# Altium schematic sheet SerialKM.SchDoc
size A4; ENG_APP_DATE: --/--/--; DSN_APP_DATE: --/--/--; CHK_APP_DATE: --/--/--; SheetNumber: 1; SheetTotal: 1
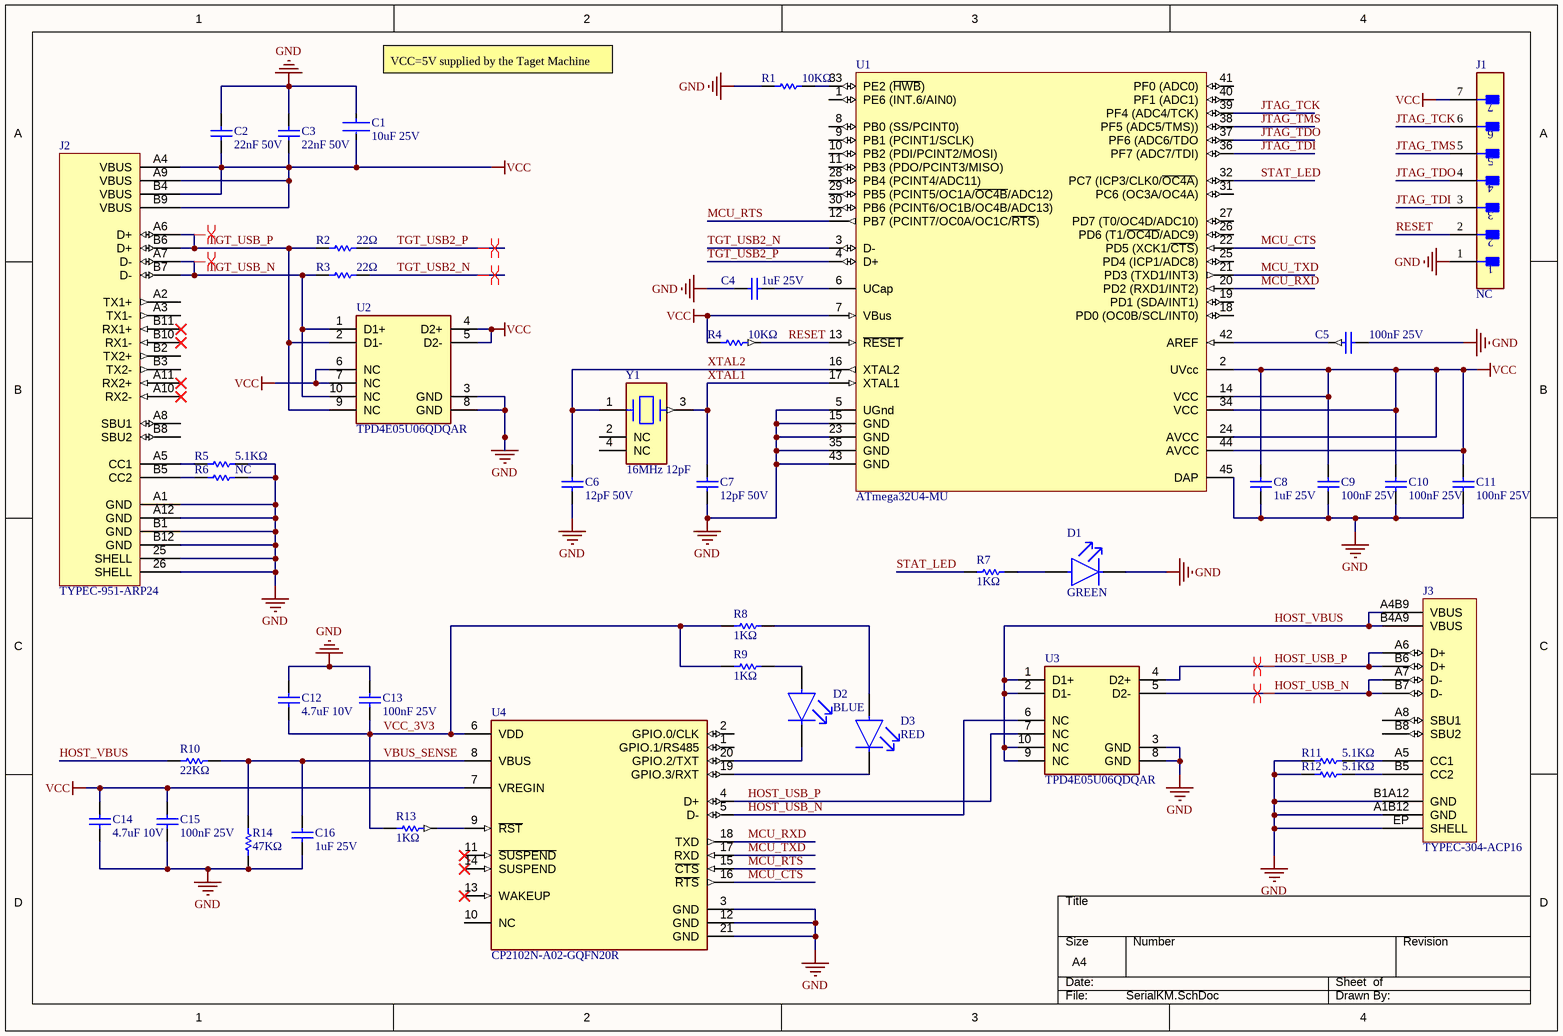
[diagram p0: SerialKM.SchDoc]

## Parts
C1  10uF 25V  [FP-C1608-080-MFG]
C2  22nF 50V  [CAPC1005X56X25LL10T15]
C3  22nF 50V  [CAPC1005X56X25LL10T15]
C4  1uF 25V  [CAPC1005X55X10LL05]
C5  100nF 25V  [CAPC1005X55X30LL05T10]
C6  12pF 50V  [CAPC1005X61X26LL10T16]
C7  12pF 50V  [CAPC1005X61X26LL10T16]
C8  1uF 25V  [CAPC1005X55X10LL05]
C9  100nF 25V  [CAPC1005X55X30LL05T10]
C10  100nF 25V  [CAPC1005X55X30LL05T10]
C11  100nF 25V  [CAPC1005X55X30LL05T10]
C12  4.7uF 10V  [CAPC1005X70X10LL20T00]
C13  100nF 25V  [CAPC1005X55X30LL05T10]
C14  4.7uF 10V  [CAPC1005X70X10LL20T00]
C15  100nF 25V  [CAPC1005X55X30LL05T10]
C16  1uF 25V  [CAPC1005X55X10LL05]
D1  GREEN  [FP-APHHS1005CGCK-MFG]
D2  BLUE  [FP-APHHS1005CGCK-MFG]
D3  RED  [FP-APHHS1005CGCK-MFG]
J1  NC  [FP-GRPB071VWVN-RC-MFG]  (no BOM)
J2  TYPEC-951-ARP24  [TYPEC-951-ARP24]
J3  TYPEC-304-ACP16  [TYPEC-304-ACP16]
R1  10KΩ  [RESC1005X40X25LL05T10]
R2  22Ω  [RESC1005X40X25LL05T05]
R3  22Ω  [RESC1005X40X25LL05T05]
R4  10KΩ  [RESC1005X40X25LL05T10]
R5  5.1KΩ  [RESC1005X40X25LL05T10]
R6  NC  [RESC1005X40X25LL05T10]
R7  1KΩ  [RESC1005X40X25LL05T10]
R8  1KΩ  [RESC1005X40X25LL05T10]
R9  1KΩ  [RESC1005X40X25LL05T10]
R10  22KΩ  [RESC1005X40X25LL05T10]
R11  5.1KΩ  [RESC1005X40X25LL05T10]
R12  5.1KΩ  [RESC1005X40X25LL05T10]
R13  1KΩ  [RESC1005X40X25LL05T10]
R14  47KΩ  [RESC1005X40X25LL05T10]
U1  ATmega32U4-MU  [44PW_L]
U2  TPD4E05U06QDQAR  [FP-DQA0010A-MFG]
U3  TPD4E05U06QDQAR  [FP-DQA0010A-MFG]
U4  CP2102N-A02-GQFN20R  [FP-CP2102N-A02-GQFN20R-MFG]
Y1  16MHz 12pF  [FP-XRCGB-MFG]

## Nets
GND: C1.1 C2.2 C3.2 C4.1 C5.1 C6.1 C7.1 C8.2 C9.1 C10.1 C11.1 C12.2 C13.2 C14.1 C15.1 C16.1 D1.1(C) J1.1 J2.25(SHELL) J2.26(SHELL) J2.A1(GND) J2.A12(GND) J2.B1(GND) J2.B12(GND) J3.A1B12(GND) J3.B1A12(GND) J3.EP(SHELL) R1.2 R5.2 R6.2 R11.1 R12.1 R14.1 U1.5(UGnd) U1.15(GND) U1.23(GND) U1.35(GND) U1.43(GND) U1.45(DAP) U2.3(GND) U2.8(GND) U3.3(GND) U3.8(GND) U4.3(GND) U4.12(GND) U4.21(GND)
VCC: C1.2 C2.1 C3.1 C8.1 C9.2 C10.2 C11.2 C14.2 C15.2 J1.7 J2.A4(VBUS) J2.A9(VBUS) J2.B4(VBUS) J2.B9(VBUS) R4.2 U1.2(UVcc) U1.7(VBus) U1.14(VCC) U1.24(AVCC) U1.34(VCC) U1.44(AVCC) U2.4(D2+) U2.5(D2-) U2.6(NC) U2.7(NC) U4.7(VREGIN)
HOST_USB_N: J3.A7(D-) J3.B7(D-) U3.5(D2-) U3.6(NC) U4.5(D-)
HOST_USB_P: J3.A6(D+) J3.B6(D+) U3.4(D2+) U3.7(NC) U4.4(D+)
HOST_VBUS: J3.A4B9(VBUS) J3.B4A9(VBUS) R10.1 U3.1(D1+) U3.2(D1-) U3.9(NC) U3.10(NC)
JTAG_TCK: J1.6 U1.39(PF4_(ADC4/TCK))
JTAG_TDI: J1.3 U1.36(PF7_(ADC7/TDI))
JTAG_TDO: J1.4 U1.37(PF6_(ADC6/TDO)
JTAG_TMS: J1.5 U1.38(PF5_(ADC5/TMS)))
MCU_CTS: U1.22(PD5_(XCK1/~{CTS})) U4.16(~{RTS})
MCU_RTS: U1.12(PB7_(PCINT7/OC0A/OC1C/~{RTS})) U4.15(~{CTS})
MCU_RXD: U1.20(PD2_(RXD1/INT2)) U4.18(TXD)
MCU_TXD: U1.21(PD3_(TXD1/INT3)) U4.17(RXD)
RESET: J1.2 R4.1 U1.13(~{RESET})
STAT_LED: R7.1 U1.32(PC7_(ICP3/CLK0/~{OC4A}))
TGT_USB2_N: R3.2 U1.3(D-)
TGT_USB2_P: R2.2 U1.4(D+)
TGT_USB_N: J2.A7(D-) J2.B7(D-) R3.1 U2.1(D1+) U2.10(NC)
TGT_USB_P: J2.A6(D+) J2.B6(D+) R2.1 U2.2(D1-) U2.9(NC)
VBUS_SENSE: C16.2 R10.2 R14.2 U4.8(VBUS)
VCC_3V3: C12.1 C13.1 R8.1 R9.2 R13.1 U4.6(VDD)
XTAL1: C7.2 U1.17(XTAL1) Y1.3(2_Crystal_terminal)
XTAL2: C6.2 U1.16(XTAL2) Y1.1(1_Crystal_terminal)
NetC4_2: C4.2 U1.6(UCap)
NetC5_2: C5.2 U1.42(AREF)
NetD1_2: D1.2(A) R7.2
NetD2_1: D2.1(C) U4.20(GPIO.2/TXT)
NetD2_2: D2.2(A) R9.1
NetD3_1: D3.1(C) U4.19(GPIO.3/RXT)
NetD3_2: D3.2(A) R8.2
NetJ2_A5: J2.A5(CC1) R5.1
NetJ2_B5: J2.B5(CC2) R6.1
NetJ3_A5: J3.A5(CC1) R11.2
NetJ3_B5: J3.B5(CC2) R12.2
NetR1_1: R1.1 U1.33(PE2_(~{HWB}))
NetR13_2: R13.2 U4.9(~{RST})

Not connected (* = marked no-connect by the designer): J2 A2(TX1+) A3(TX1-) A8(SBU1) A10(RX2-)* A11(RX2+)* B2(TX2+) B3(TX2-) B8(SBU2) B10(RX1-)* B11(RX1+)*; J3 A8(SBU1) B8(SBU2); U1 1(PE6_(INT.6/AIN0)) 8(PB0_(SS/PCINT0)) 9(PB1_(PCINT1/SCLK)) 10(PB2_(PDI/PCINT2/MOSI)) 11(PB3_(PDO/PCINT3/MISO)) 18(PD0_(OC0B/SCL/INT0)) 19(PD1_(SDA/INT1)) 25(PD4_(ICP1/ADC8)) 26(PD6_(T1/~{OC4D}/ADC9)) 27(PD7_(T0/OC4D/ADC10)) 28(PB4_(PCINT4/ADC11)) 29(PB5_(PCINT5/OC1A/~{OC4B}/ADC12)) 30(PB6_(PCINT6/OC1B/OC4B/ADC13)) 31(PC6_(OC3A/OC4A)) 40(PF1_(ADC1)) 41(PF0_(ADC0)); U4 1(GPIO.1/RS485) 2(GPIO.0/CLK) 10(NC) 11(~{SUSPEND})* 13(WAKEUP)* 14(SUSPEND)*; Y1 2(NC) 4(NC)

## Layout directives
differential pair; rule Impedance Constraint [Min = 89.00    Max = 91.00    ]; differential pair class USB: HOST_USB_N, HOST_USB_P, TGT_USB2_N, TGT_USB2_P, TGT_USB_N, TGT_USB_P

## Notes on the sheet
- VCC=5V supplied by the Taget Machine
- THIS DOCUMENT AND THE DATA DISCLOSED HEREIN OR
- HEREWITH IS THE PROPERTY OF ALTIUM LIMITED AND MAY
- DWG NO:
- REVISION
- REV:
- DESCRIPTION
- DATE
- APPROVED
- BE FREELY DISTRIBUTED IN WHOLE. NO RIGHTS ARE
- RESERVED OR EXPRESS OR IMPLIED WARANTEE GIVEN.
- ENG:
- APPROVALS
- PROJECT
- DSN:
- CHK:
- REFERENCE DOCUMENTS
- PROJECT REVISION:
- TITLE
- DOCUMENT REVISION:
- DESIGN ITEM:
- BOM:
- FAB DWG:
- PCB DWG:
- ASSY DWG:
- SCALE:
- A3
- SIZE
- CAGE CODE
- FILE NAME
- DWG NO.
- SHEET
- OF
- REV

## Library data of the parts
C1 = CMP-2000-05442-2: CAP CER 10UF 25V X5R 0603; Dielectric Material: Ceramic; Tolerance: 20%; Dielectric: X5R; Length: 1.6mm; Termination: SMD/SMT; Depth: 0.8mm; RoHS Compliant: Yes; Construction: Flat; Weight: 7.1E-05oz; Thickness: 0.039inch; Packaging: Tape and Reel; Min Operating Temperature: -55°C; Case Code (Imperial): 0603; Case/Package: 0603; Height: 0.8mm; Case Code (Metric): 1608; Voltage Rating: 25V; Resistor Type: Ceramic; Voltage Rating (DC): 25V; Max Operating Temperature: 85°C; REACH SVHC: No SVHC; Lead Free: Lead Free; Series: C; Width: 0.8mm; Mount: Surface Mount; Package Quantity: 1; Capacitance: 10uF
C2 C3 = CMP-2008-00029-1: Part Number: CM05X7R223K16AH.; Manufacturer: AVX Interconnect / Elco
C4 C8 C16 = CMP-2000-05003-1: Chip Capacitor, 1 uF, +/- 10%, 16 V, -55 to 85 degC, 0402 (1005 Metric), RoHS, Tape and Reel; PCN Part Number: MLCCPartNumberChange30/Nov/2012; Manufacturer: TDK; Capacitance: 1µF; Online Catalog: CSeries,GeneralPurpose; Other Names: 445-4978-6; Temperature Coefficient: X5R; Product Training Modules: CSeriesGeneralApplicationsSEAT,CCV,andTVCLDesignToolsGuidetoReplacinganElectrolyticCapacitorwithanMLCC; Voltage - Rated: 16V; Packaging: Digi-Reel; Tolerance: ±10%; Lead Spacing: -; Size / Dimension: 0.039"Lx0.020"W(1.00mmx0.50mm); Lead Style: -; Operating Temperature: -55degC~85degC; Series: C; Datasheet Version: Oct-13; Applications: GeneralPurpose; Family: CeramicCapacitors; Height - Seated (Max): -; Standard Package: 1; RoHS Information: RoHSCertificate-MLCC; Ratings: -; Package Description: 2-Pin Surface Mount Device, Body 1 x 0.5 mm; Package / Case: 0402(1005Metric); Category: Capacitors; Package Reference: 402; Datasheet URL: https://datasheet.ciiva.com/14482/1756136-14482760.pdf; Manufacturer URL: http://www.tdk.com/; Features: -; Mounting Type: SurfaceMount,MLCC; Thickness (Max): 0.022"(0.55mm)
C5 C9-C11 C13 C15 = CMP-0001-00074-2: Manufacturer: Kemet; Part Number: C0402C104K4RACTU
C6 C7 = CMP-2008-01992-1: Part Number: VJ0402D120JXCAJ; Manufacturer: Vitramon
C12 C14 = CMP-2008-00074-1: Manufacturer: AVX Interconnect / Elco; Part Number: TACK475M003QTA
D1 = CMP-44529-000044-1: LED CLEAR CHIP SMD; Viewing Angle: 120°; Dominant Wavelength: 570nm; Test Current: 20mA; Luminous Intensity: 50mcd; Forward Voltage: 2.1V; Number of LEDs: 1; Lens Color: Clear; Packaging: Tape and Reel; Max Operating Temperature: 85°C; Illumination Color: Green; Length: 1mm; Mount: Surface Mount; Lens Style: Clear; Color: Green; Number of Pins: 2; Wavelength: 570nm; Case/Package: 0402; Width: 0.5mm; Package Quantity: 2000; Case Code (Metric): 1005; Height: 0.6mm; Lead Free: Lead Free; Case Code (Imperial): 0402; Forward Current: 20mA; Min Operating Temperature: -40°C
D2 D3 = CMP-44529-000044-1: LED CLEAR CHIP SMD; Illumination Color: Green; Viewing Angle: 120°; Dominant Wavelength: 570nm; Test Current: 20mA; Luminous Intensity: 50mcd; Forward Voltage: 2.1V; Number of LEDs: 1; Lens Color: Clear; Packaging: Tape and Reel; Max Operating Temperature: 85°C; Length: 1mm; Mount: Surface Mount; Lens Style: Clear; Color: Green; Number of Pins: 2; Wavelength: 570nm; Case/Package: 0402; Width: 0.5mm; Package Quantity: 2000; Case Code (Metric): 1005; Height: 0.6mm; Lead Free: Lead Free; Case Code (Imperial): 0402; Forward Current: 20mA; Min Operating Temperature: -40°C
J1 = CMP-25680-000036-1: Debug header; Pitch: 0.05inch; Connector Type: Male Pin; Number of Positions: 7; Contact Mating Length: 0.118inch; Number of Rows: 1; Mount: Through Hole; Packaging: Bulk; Contact Type: Male Pin; Contact Plating: Gold; Termination: Solder; Lead Free: Lead Free; Package Quantity: 1; RoHS Compliant: Yes
J2 = TYPEC-951-ARP24: Xunpu TYPEC-951-ARP24 USB Type-C Male Connector SMD; Supplier 1: LCSC; Supplier Part Number 1: C2856663
J3 = TYPEC-304-ACP16: Xunpu TYPEC-304-ACP16 USB Type-C  Socket 16P SMD; Supplier 1: LCSC; Supplier Part Number 1: C2982555
R1 R4-R14 = CMP-2002-07753-1: Part Number: RC0402FR-075K1L; Manufacturer: Yageo / Phycomp
R2 R3 = CMP-2002-08382-1: Manufacturer: Vishay Dale; Part Number: CRCW040222R0FKED
U1 = CMP-0095-00166-2: 8-bit AVR Microcontroller, 2.7-5.5V, 16MHz, 32KB Flash, 1KB EEPROM, 2.5KB SRAM, USB Controller, 44-pin QFN, Industrial Grade (-40°C to 85°C), Ext Osc; PackageVersion: revG, Sep-2009; PackageReference: 44PW; ComponentLink1URL: http://www.atmel.com/; PackageDescription: 44-Pin Quad Flat No-Lead Package, 7 x 7 mm Body, 0.5 mm Pitch (QFN); ComponentLink3Description: ATmega16U4 ATmega32U4 Summary; RevisionNote: DatasheetVersion, PackageVersion & PCB updated. URLs added.; ComponentLink2Description: ATmega16U4/32U4 Datasheet; ComponentLink1Description: Manufacturer URL; ComponentLink3URL: http://www.atmel.com/dyn/resources/prod_documents/7766S.pdf; DatasheetVersion: revF, Nov-2010; ComponentLink2URL: http://www.atmel.com/dyn/resources/prod_documents/doc7766.pdf; Code_JEDEC: MO-220-VKKD-1
U2 U3 = CMP-04985-000004-1: TVS DIODE 5.5V 14V 10USON; Manufacturer Part Number: TPD4E05U06QDQARQ1; Manufacturer: Texas Instruments; Direction: Unidirectional; Standoff Height: 0mm; Capacitance: 0.5pF; Number Of Channels: 4; Breakdown Voltage: 6.4V; Peak Pulse Power: 2.5W; Automotive Grade: Grade 1; Value: 0.5pF; Interface: USB,Ethernet,LVDS,Other; Peak Pulse Current: 2.5A; Operating Supply Voltage: 5.5V; Reverse Standoff Voltage: 5.5V; Package: DQA0010A; Temperature Range Low: -40°C; Temperature Range High: +125°C; Ambient Temperature Range Low: -40°C; Device Class L1: Circuit Protection; Clamping Voltage: 14V; Device Class L2: ESD and Circuit Protection ICs; Octopart: https://octopart.com/tpd4e05u06qdqarq1-texas+instruments-48523459; Device Class L3: unset; Height: 0.55mm; Automotive: Yes; ComponentLink2Description: Datasheet; RoHS: TRUE; Ambient Temperature Range High: +125°C; Category: IC; Mouser Description: Automotive 4-Channel ESD Protection Solution for SuperSpeed (up to 5 Gbps) Interface 10-USON -40 to 125; Temperature: -40°C to +125°C; ComponentLink2URL: http://www.ti.com/lit/ds/symlink/tpd4e05u06-q1.pdf; Digikey Description: TVS DIODE 5.5V 14V 10USON; Lead Free: Yes
U4 = CMP-08107-000007-1: IC USB TO UART BRIDGE QFN20
Y1 = CMP-06054-000003-2: CRYSTAL 16.0000MHZ; Series Resistance: 150R; Load Capacitance: 6pF; Frequency Stability: 20ppm; Frequency: 27MHz; Case/Package: SMD/SMT; Packaging: Tape and Reel; REACH SVHC: No SVHC; Min Operating Temperature: -30°C; Frequency Tolerance: 20ppm; Max Operating Temperature: 85°C; Height: 0.028inch; Width: 1.6mm; Number of Pins: 3; Package Quantity: 3000; Termination: SMD/SMT; ESR (Equivalent Series Resistance): 150R; Mount: Surface Mount; Tolerance: 20ppm; Length: 2mm